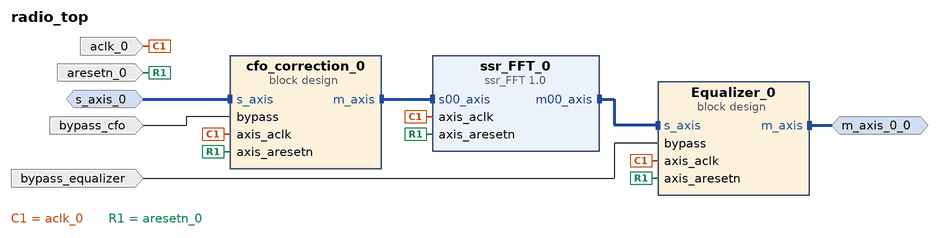
[diagram p0: block diagram of the top level]
# Vivado block design radio_top, xczu28dr-ffvg1517-2-e, Vivado 2022.1
create_bd_design radio_top

create_bd_intf_port -mode Master -vlnv xilinx.com:interface:axis_rtl:1.0 m_axis_0_0
set_property -dict {CONFIG.FREQ_HZ 250000000} [get_bd_intf_ports m_axis_0_0]
create_bd_intf_port -mode Slave -vlnv xilinx.com:interface:axis_rtl:1.0 s_axis_0
set_property -dict [list \
  CONFIG.FREQ_HZ 250000000 \
  CONFIG.HAS_TKEEP 0 \
  CONFIG.HAS_TLAST 1 \
  CONFIG.HAS_TREADY 0 \
  CONFIG.HAS_TSTRB 0 \
  CONFIG.LAYERED_METADATA undef \
  CONFIG.TDATA_NUM_BYTES 16 \
  CONFIG.TDEST_WIDTH 0 \
  CONFIG.TID_WIDTH 8 \
  CONFIG.TUSER_WIDTH 8 \
] [get_bd_intf_ports s_axis_0]
create_bd_port -dir I -type clk aclk_0
set_property -dict {CONFIG.ASSOCIATED_BUSIF m_axis_0_0:s_axis_0 CONFIG.FREQ_HZ 250000000} [get_bd_ports aclk_0]
create_bd_port -dir I -type rst aresetn_0
create_bd_port -dir I bypass_cfo
create_bd_port -dir I bypass_equalizer

create_bd_cell -type container -reference Equalizer Equalizer_0
set_property -dict [list \
  CONFIG.ACTIVE_SIM_BD Equalizer.bd \
  CONFIG.ACTIVE_SYNTH_BD Equalizer.bd \
  CONFIG.ENABLE_DFX 0 \
  CONFIG.LIST_SIM_BD Equalizer.bd \
  CONFIG.LIST_SYNTH_BD Equalizer.bd \
  CONFIG.LOCK_PROPAGATE 0 \
] [get_bd_cells Equalizer_0]
create_bd_cell -type container -reference cfo_correction cfo_correction_0
set_property -dict [list \
  CONFIG.ACTIVE_SIM_BD cfo_correction.bd \
  CONFIG.ACTIVE_SYNTH_BD cfo_correction.bd \
  CONFIG.ENABLE_DFX 0 \
  CONFIG.LIST_SIM_BD cfo_correction.bd \
  CONFIG.LIST_SYNTH_BD cfo_correction.bd \
  CONFIG.LOCK_PROPAGATE 0 \
] [get_bd_cells cfo_correction_0]
create_bd_cell -type ip -vlnv xilinx.com:user:ssr_FFT:1.0 ssr_FFT_0

# ---- connections ----

connect_bd_intf_net [get_bd_intf_ports m_axis_0_0] [get_bd_intf_pins Equalizer_0/m_axis]
connect_bd_intf_net [get_bd_intf_pins ssr_FFT_0/s00_axis] [get_bd_intf_pins cfo_correction_0/m_axis]
connect_bd_intf_net -intf_net s_axis_0_1 [get_bd_intf_ports s_axis_0] [get_bd_intf_pins cfo_correction_0/s_axis]
connect_bd_intf_net [get_bd_intf_pins ssr_FFT_0/m00_axis] [get_bd_intf_pins Equalizer_0/s_axis]
connect_bd_net -net aclk_0_1 [get_bd_ports aclk_0] \
  [get_bd_pins Equalizer_0/axis_aclk] [get_bd_pins cfo_correction_0/axis_aclk] [get_bd_pins ssr_FFT_0/axis_aclk]
connect_bd_net -net aresetn_0_1 [get_bd_ports aresetn_0] \
  [get_bd_pins Equalizer_0/axis_aresetn] [get_bd_pins cfo_correction_0/axis_aresetn] [get_bd_pins ssr_FFT_0/axis_aresetn]
connect_bd_net -net bypass_0_1 [get_bd_ports bypass_cfo] [get_bd_pins cfo_correction_0/bypass]
connect_bd_net -net bypass_0_2 [get_bd_ports bypass_equalizer] [get_bd_pins Equalizer_0/bypass]

validate_bd_design
save_bd_design
